# EAGLE design ESPLEDCTRL (EAGLE 8.6.0)
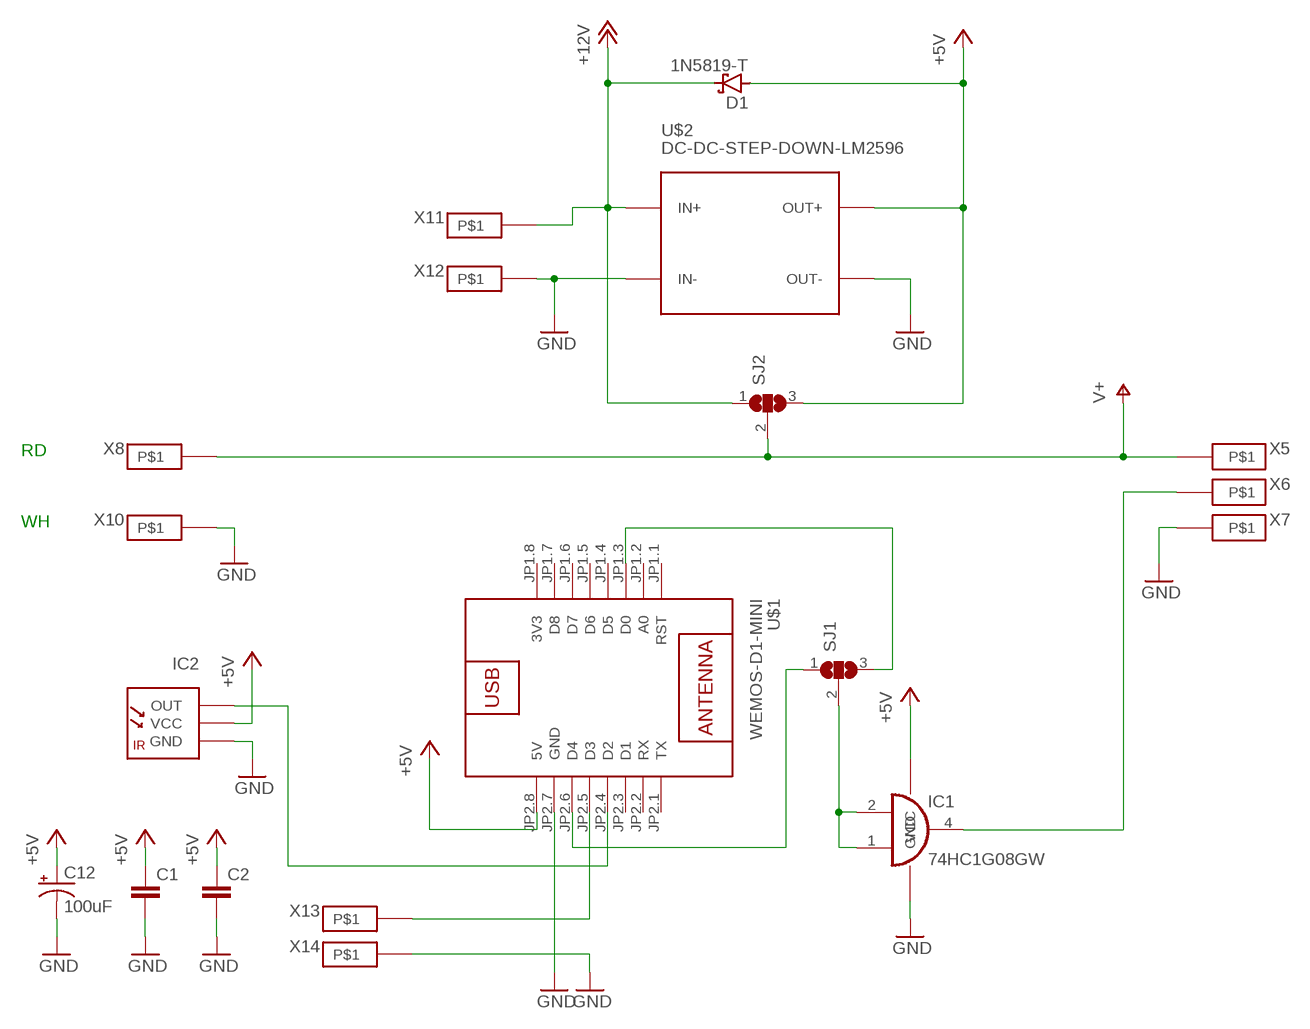
[diagram p0: schematic, sheet 1]

## Parts
C1  C-EUC1206  [C1206]
C2  C-EUC1206  [C1206]
C12  100uF  CPOL-USD  [PANASONIC_D]
D1  1N5819-T  [DO41-7.6]
IC1  74HC1G08GW  [SOT353]
IC2  TSOP382  [TSOP38]
SJ1  SJ2W  [SJ_2]
SJ2  SJ2W  [SJ_2]
U$1  WEMOS-D1-MINI  [WEMOS-D1-MINI]
U$2  DC-DC-STEP-DOWN-LM2596  [DC-DC-STEP-DOWN-LM2596]
X5  PAD2X4  [PAD2X4]
X6  PAD2X4  [PAD2X4]
X7  PAD2X4  [PAD2X4]
X8  PAD2X4  [PAD2X4]
X10  PAD2X4  [PAD2X4]
X11  PAD2X4  [PAD2X4]
X12  PAD2X4  [PAD2X4]
X13  PAD2X4  [PAD2X4]
X14  PAD2X4  [PAD2X4]

## Nets
+5V: C1.1 C2.1 C12.+ D1.A IC1.5(VCC) IC2.3(VCC) SJ2.3 U$1.JP2.8(5V) U$2.OUT+
+12V: D1.C SJ2.1 U$2.IN+ X11.P$1
GND: C1.2 C2.2 C12.- IC1.3(GND) IC2.2(GND) U$1.JP2.7(GND) U$2.IN- U$2.OUT- X7.P$1 X10.P$1 X12.P$1 X14.P$1
N$1: U$1.JP2.5(D3) X13.P$1
N$2: IC2.1(OUT) U$1.JP2.4(D2)
N$15: SJ1.1 U$1.JP2.6(D4)
N$16: IC1.1(I1) IC1.2(I0) SJ1.2
N$17: SJ1.3 U$1.JP1.3(D0)
N$18: IC1.4(O) X6.P$1
V+: SJ2.2 X5.P$1 X8.P$1
Unconnected: U$1.JP1.1(RST) U$1.JP1.2(A0) U$1.JP1.4(D5) U$1.JP1.5(D6) U$1.JP1.6(D7) U$1.JP1.7(D8) U$1.JP2.1(TX) U$1.JP2.2(RX) U$1.JP2.3(D1)

## Notes on the sheet
- RD
- WH

## Power pins joined to a net without a drawn wire
3V3: U$1.JP1.8(3V3)

## Library data of the parts
C1 C2 = rcl:C-EU: CAPACITOR, European symbol; SPICEPREFIX: C
C12 = rcl:CPOL-US: POLARIZED CAPACITOR, American symbol
D1 = diode:1N581*: 1.0A SCHOTTKY BARRIER RECTIFIER Source: http://www.diodes.com/datasheets/ds23001.pdf
IC1 = Logik-IC:74HC1G08
IC2 = modules:TSOP382
SJ1 SJ2 = jumper:SJ2W: SMD solder JUMPER
U$1 = diy-modules:WEMOS-D1-MINI: WEMOS D1 mini: Mini Wi-Fi Board based on ESP-8266 device More details can be found here: https://www.wemos.cc/product/d1-mini.html Click here to find device on ebay.com <http://www.ebay.com/sch/wemos+d1+mini+nodemcu>
U$2 = diy-modules:DC-DC-STEP-DOWN-LM2596: DC/DC Step-Down Regulator based on LM2596-ADJ chip LM2596 datasheet available here: http://www.ti.com/lit/ds/symlink/lm2596.pdf Click here to find device on ebay.com <http://www.ebay.com/sch/lm2596+power+regulator>
X5-X8 X10-X14 = modules:PAD

## Board
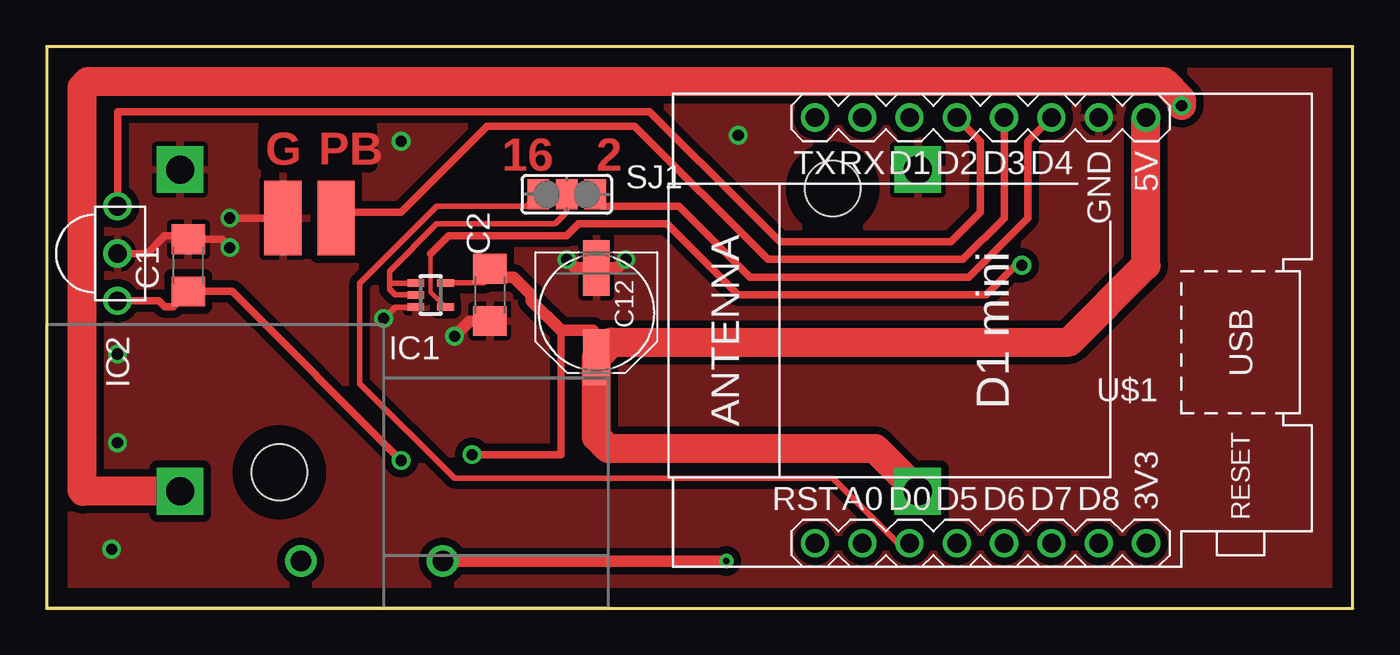
[diagram p1: board, top side]
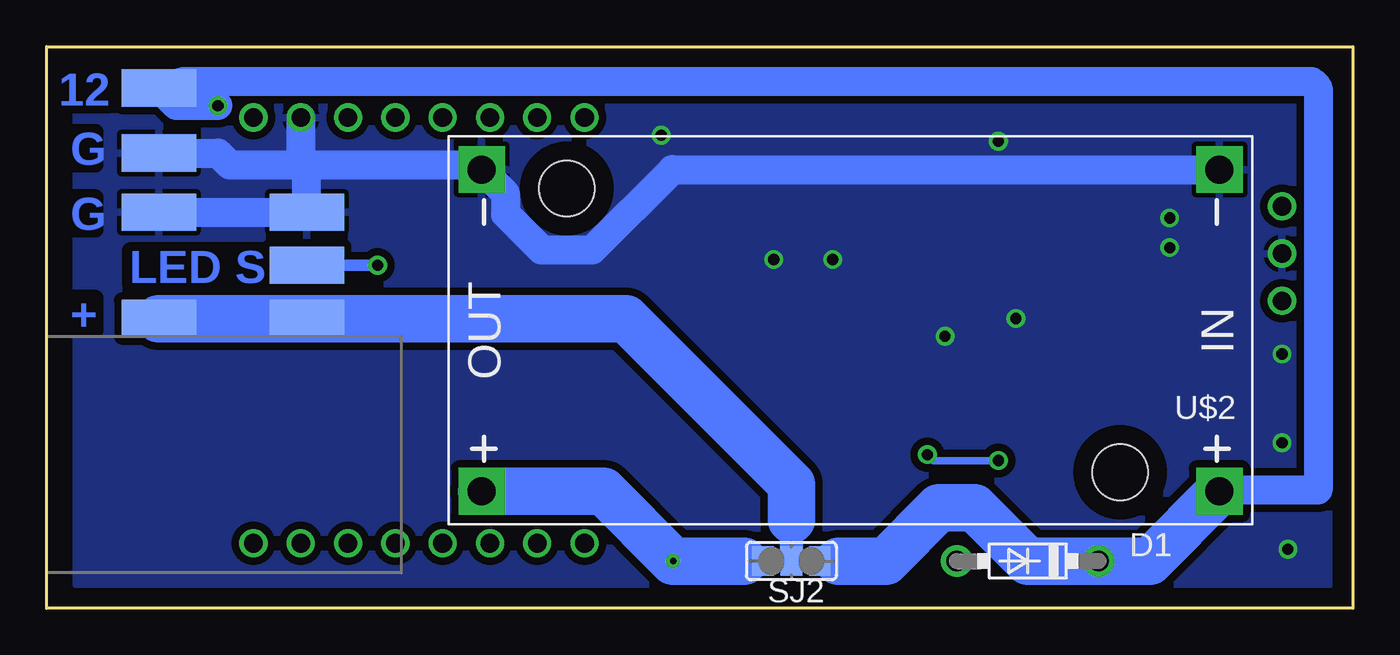
[diagram p2: board, bottom side, seen from below]

Size 70.17 x 30.16 mm. Coordinates in mm from the lower left corner, seen from the top.
Outline: 0,30.16 0,0 70.17,0 70.17,30.16 0,30.16
Copper layers (1*16): Top 0.035mm / dielectric 1.5mm / Bottom 0.035mm
Design rules "default": minimum track width 6mil, minimum drill 0.35mm, track to track 6mil, track to pad 6mil, pad to pad 6mil, via to via 6mil, smd to smd 6mil, copper to edge 40mil, drill to drill 6mil, minimum pad ring 10mil, minimum via ring 8mil, stop-mask expansion 4mil, vias tented up to drill 0mil, thermal gap 10mil

### Footprints (pad centres in the part's own frame; a part is rotated, then mirrored left to right if it is on the bottom)
C1206 = smd 1.6 x 1.8: 1 -1.4,0; 2 1.4,0
PANASONIC_D = smd 3 x 1.4: + 2.4,0; - -2.4,0
DO41-7.6 = drill 1.1 pad 1.7: A 3.81,0; C -3.81,0
SOT353 = smd 0.4 x 0.9: 1 -0.65,-0.8; 2 0,-0.8; 3 0.65,-0.8; 4 0.65,0.8; 5 -0.65,0.8
TSOP38 = drill 1: 1 -2.54,0; 2 0,0; 3 2.54,0
SJ_2 = smd 1.168 x 1.6: 1 -1.524,0; 2 0,0; 3 1.524,0
WEMOS-D1-MINI = drill 1: JP1.1 -11.43,9.525; JP1.2 -11.43,6.985; JP1.3 -11.43,4.445; JP1.4 -11.43,1.905; JP1.5 -11.43,-0.635; JP1.6 -11.43,-3.175; JP1.7 -11.43,-5.715; JP1.8 -11.43,-8.255; JP2.1 11.43,9.525; JP2.2 11.43,6.985; JP2.3 11.43,4.445; JP2.4 11.43,1.905; JP2.5 11.43,-0.635; JP2.6 11.43,-3.175; JP2.7 11.43,-5.715; JP2.8 11.43,-8.255
DC-DC-STEP-DOWN-LM2596 = drill 1.5 pad 2.5 square: IN+ -19.812,8.636; IN- -19.812,-8.636; OUT+ 19.812,8.636; OUT- 19.812,-8.636 | hole 3: -14.478,7.62; 15.24,-7.62
PAD2X4 = smd 4 x 2: P$1 0,0

### Placement (x,y rotation side)
C1  7.62,18.41 90 top
C2  23.81,16.83 270 top
C12  29.53,15.88 270 top
D1  17.46,2.54 180 bottom
IC1  20.64,16.83 270 top
IC2  3.81,19.05 270 top
SJ1  27.94,22.22 180 top
SJ2  30.16,2.54 180 bottom
U$1  50.8,14.92 90 top
U$2  26.99,14.92 180 bottom
X5  56.2,15.56 0 bottom
X6  56.2,18.41 0 bottom
X7  56.2,21.27 0 bottom
X8  64.14,15.56 0 bottom
X10  64.14,21.27 0 bottom
X11  64.14,27.94 0 bottom
X12  64.14,24.45 0 bottom
X13  15.56,20.95 90 top
X14  12.7,20.95 90 top

### Tracks (layer width: path | path; a pad name or v marks a point on that pad's centre or on a via)
+5V  (via drill 0.35, 0.6)
  Top 0.305: IC1.5 23.51,17.48 23.81,17.78 C2.1
  Top 0.406: IC2.3 6.03,16.51 6.35,16.19 6.8,16.19 C1.1 9.97,17.01 v19.05,7.94 | v22.86,8.26 27.62,8.26 27.62,14.92
  Top 0.61: D1.A v36.51,2.54 | C12.+ 29.35,14.92 27.62,14.92 26.03,16.51 26.03,16.83 25.08,17.78 23.81,17.78
  Top 1.55: U$2.OUT+ 44.51,8.57 30.16,8.57 29.53,9.21 C12.+ 30.34,14.29 54.93,14.29 59.05,18.41 U$1.JP2.8
  Bottom 0.406: v19.05,7.94 22.54,7.94 v22.86,8.26
  Bottom 0.813: SJ2.3 32.7,2.54
  Bottom 2.54: U$2.OUT+ 40.26,6.29 v36.51,2.54 32.7,2.54
+12V  (via drill 0.6)
  Top 1.55: U$2.IN+ 1.97,6.29 1.91,6.35 1.91,27.98 2.22,28.3 59.97,28.3 60.96,27.31 v60.96,26.99
  Bottom 0.813: 27.62,2.54 SJ2.1
  Bottom 1.55: 7.11,6.35 1.87,6.35 1.87,27.94 2.22,28.3 62.83,28.3 X11.P$1 63.18,26.99 v60.96,26.99 | 7.11,6.35 U$2.IN+ | 7.3,6.03 7.11,6.22 7.11,6.35
  Bottom 2.54: U$2.IN+ 10.92,2.54 D1.C 17.46,2.54 20.32,5.4 22.23,5.4 25.08,2.54 27.62,2.54
GND  (via drill 0.6)
  Top 0.305: IC1.3 18.72,16.18 v18.1,15.56
  Top 0.406: IC2.2 5.4,19.05 6.35,20 7.43,20 C1.2 9.39,19.82 v9.84,19.37 | X14.P$1 v9.84,20.95
  Top 0.61: v31.12,18.73 30.66,18.27 C12.- 28.4,18.27 v27.94,18.73 | C2.2 22.73,15.43 v21.91,14.6
  Bottom 1.55: X12.P$1 60.96,24.45 60.32,23.81 56.52,23.81 | 56.52,23.81 47.05,23.81 U$2.OUT- 45.52,22.28 45.52,21.18 43.59,19.25 40.86,19.25 36.56,23.56 U$2.IN- | U$1.JP2.7 56.52,23.81 | X10.P$1 X7.P$1 56.2,23.5 56.52,23.81
  other vias: 3.49,3.18 3.81,13.65 3.81,8.89 19.05,25.08 37.15,25.4
  pour Bottom (isolate 0.406): 1.27,28.89 68.58,28.89 68.58,1.27 1.27,1.27
  pour Top (isolate 0.406): 1.27,28.89 68.9,28.89 68.9,1.27 1.27,1.27
N$1
  Top 0.406: U$1.JP2.5 51.43,20.95 49.21,18.73 38.73,18.73 31.59,25.88 23.65,25.88 19.05,21.27 15.88,21.27 X13.P$1
N$2
  Top 0.406: U$1.JP2.4 50.16,25.08 50.16,21.27 48.58,19.68 39.41,19.68 37.8,21.25 32.38,26.67 3.81,26.67 IC2.1
N$15
  Top 0.406: U$1.JP2.6 52.7,25.08 52.7,20.95 49.53,17.78 37.78,17.78 33.97,21.59 29.84,21.59 SJ1.1
N$16
  Top 0.305: IC1.2 18.73,16.83 18.41,17.15 18.41,17.46 | 18.41,17.46 19.82,17.46 IC1.1 | 18.41,17.46 18.41,18.1 20.95,20.64 27.3,20.64 27.94,21.27 SJ1.2
N$17
  Top 0.305: U$1.JP1.3 45.72,3.49 42.23,6.99 21.91,6.99 16.83,12.07 16.83,17.46 20.95,21.59 24.45,21.59 25.78,21.59 SJ1.3
N$18  (via drill 0.6)
  Top 0.254: IC1.4 20.64,16.98 20.64,19.05
  Top 0.406: 20.64,19.05 21.59,20 27.94,20 28.58,20.64 33.34,20.64 37.15,16.83 50.48,16.83 52.07,18.41 v52.39,18.41
  Bottom 0.61: v52.39,18.41 X6.P$1
V+
  Bottom 1.27: SJ2.2 30.16,4.76
  Bottom 2.54: X8.P$1 X5.P$1 39.05,15.56 30.16,6.67 30.16,4.76

### Text on the board
Top: G | PB | 16 | 2
Bottom: 12 | G | G | LED S | +
tStop: G | PB | 16 | 2
bStop: 12 | G | G | LED S | + | 12 | 5